# EAGLE schematic breadboard_shield (EAGLE 7.7.0)
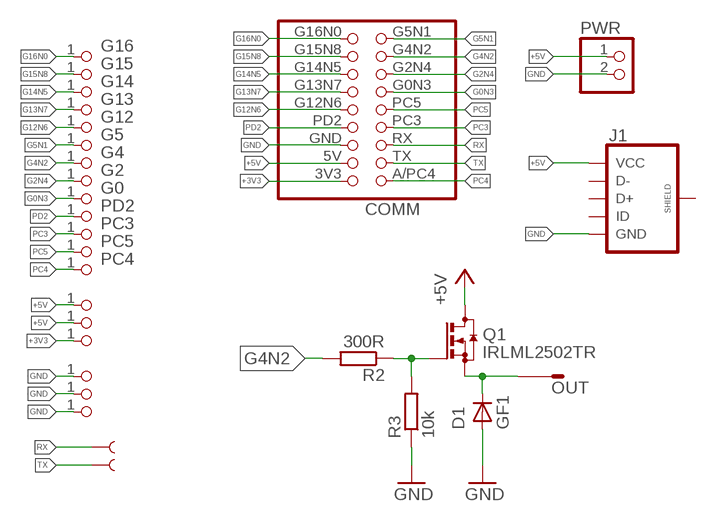
[diagram p0: schematic, sheet 1]

## Parts
+3V  PINHD-1X1  [1X01]
+5V  PINHD-1X1  [1X01]
+5V1  +5V  PINHD-1X1  [1X01]
COMM  COMM_V2LEFT  [COMM_V2_L(SHIELD)]
D1  GF1  [SMA-DO214AC]
G0  PINHD-1X1  [1X01]
G2  PINHD-1X1  [1X01]
G4  PINHD-1X1  [1X01]
G5  PINHD-1X1  [1X01]
G12  PINHD-1X1  [1X01]
G13  PINHD-1X1  [1X01]
G14  PINHD-1X1  [1X01]
G15  PINHD-1X1  [1X01]
G16  PINHD-1X1  [1X01]
GND  PINHD-1X1  [1X01]
GND1  GND  PINHD-1X1  [1X01]
GND2  GND  PINHD-1X1  [1X01]
J1  USB_MICROB_PLUGCONN-11752  [USB-B-MICRO-SMD_V03]
OUT  M01PTH  [1X01]
PC3  PINHD-1X1  [1X01]
PC4  PINHD-1X1  [1X01]
PC5  PINHD-1X1  [1X01]
PD2  PINHD-1X1  [1X01]
PWR  PINHD-1X2  [1X02]
Q1  IRLML2502TR  BSS123  [SOT23]
R2  300R  R-EU_R0805  [R0805]
R3  10k  R-EU_R0805  [R0805]
RX  TEST-POINT3X4  [PAD.03X.04]
TX  TEST-POINT3X4  [PAD.03X.04]

## Nets
+3V3: +3V.1 COMM.3V3(+3V3)
+5V: +5V1.1 +5V.1 COMM.5V(+5) J1.VBUS(VCC) PWR.1 Q1.3(D)
G0N3: COMM.G0N3 G0.1
G2N4: COMM.G2N4 G2.1
G4N2: COMM.G4N2 G4.1 R2.2
G5N1: COMM.G5N1 G5.1
G12N6: COMM.G12N6 G12.1
G13N7: COMM.G13N7 G13.1
G14N5: COMM.G14N5 G14.1
G15N8: COMM.G15N8 G15.1
G16N0: COMM.G16N0 G16.1
GND: COMM.GND D1.A GND1.1 GND2.1 GND.1 J1.GND PWR.2 R3.1
N$1: Q1.1(G) R2.1 R3.2
OUT: D1.K(C) OUT.1 Q1.2(S)
PC3: COMM.PC3 PC3.1
PC4: COMM.A/PC4(ADC_PC4) PC4.1
PC5: COMM.PC5(PC4) PC5.1
PD2: COMM.PD2 PD2.1
RX: COMM.RX RX.P$1
TX: COMM.TX TX.P$1
Unconnected: J1.D+ J1.D- J1.ID J1.SHIELD1(SHIELD) J1.SHIELD2(SHIELD) J1.SHIELD3(SHIELD)

## Library data of the parts
+3V +5V +5V1 G0 G2 G4 G5 G12-G16 GND GND1 GND2 PC3-PC5 PD2 = pinhead:PINHD-1X1: PIN HEADER
COMM = ESP12:COMM_V2: Iupitter comm socket 2.54 mm
D1 = diode:GF1: DIODE
J1 = SparkFun-Connectors:USB_MICROB_PLUG: USB Micro-B connectors Some male, some female. Watch your step!; PROD_ID: CONN-11752
OUT = SparkFun-Connectors:M01: Header 1 Standard 1-pin 0.1" header. Use with straight break away headers (SKU : PRT-00116), right angle break away headers (PRT-00553), swiss pins (PRT-00743), machine pins (PRT-00117), and female headers (PRT-00115). SMTSO-256-ET is a "flush mount" nut for a 4-40 screw. The older package used to be too tight, and did not allow it to sit properly thru the drill hit. The latest (0.165DIA) fits nice and snug.
PWR = pinhead:PINHD-1X2: PIN HEADER
Q1 = transistor-small-signal:BSS123: N-CHANNEL MOS FET
R2 R3 = rcl:R-EU_: RESISTOR, European symbol
RX TX = SparkFun-Passives:TEST-POINT: Bare copper test points for troubleshooting or ICT